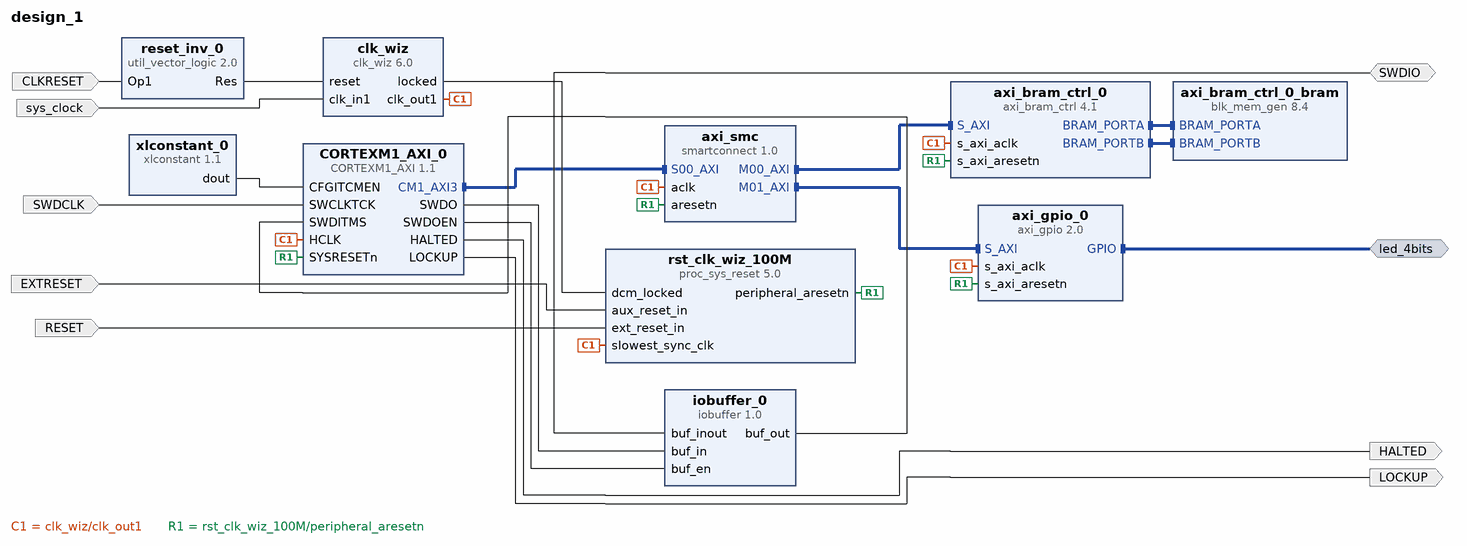
[diagram p0: block diagram of the top level]
# Vivado block design design_1, xc7a35ticsg324-1L, Vivado 2022.2
create_bd_design design_1

create_bd_intf_port -mode Master -vlnv xilinx.com:interface:gpio_rtl:1.0 led_4bits
create_bd_port -dir I -type rst CLKRESET
set_property -dict {CONFIG.POLARITY ACTIVE_LOW} [get_bd_ports CLKRESET]
create_bd_port -dir I -type rst EXTRESET
create_bd_port -dir O HALTED
create_bd_port -dir O LOCKUP
create_bd_port -dir I -type rst RESET
set_property -dict {CONFIG.POLARITY ACTIVE_LOW} [get_bd_ports RESET]
create_bd_port -dir I SWDCLK
create_bd_port -dir IO SWDIO
create_bd_port -dir I -type clk sys_clock
set_property -dict {CONFIG.FREQ_HZ 100000000 CONFIG.PHASE 0.0} [get_bd_ports sys_clock]

create_bd_cell -type ip -vlnv arm.com:CortexM:CORTEXM1_AXI:1.1 CORTEXM1_AXI_0
create_bd_cell -type ip -vlnv xilinx.com:ip:axi_bram_ctrl:4.1 axi_bram_ctrl_0
create_bd_cell -type ip -vlnv xilinx.com:ip:blk_mem_gen:8.4 axi_bram_ctrl_0_bram
set_property -dict {CONFIG.Memory_Type True_Dual_Port_RAM} [get_bd_cells axi_bram_ctrl_0_bram]
create_bd_cell -type ip -vlnv xilinx.com:ip:axi_gpio:2.0 axi_gpio_0
set_property -dict {CONFIG.GPIO_BOARD_INTERFACE led_4bits CONFIG.USE_BOARD_FLOW true} [get_bd_cells axi_gpio_0]
create_bd_cell -type ip -vlnv xilinx.com:ip:smartconnect:1.0 axi_smc
set_property -dict {CONFIG.NUM_MI 2 CONFIG.NUM_SI 1} [get_bd_cells axi_smc]
create_bd_cell -type ip -vlnv xilinx.com:ip:clk_wiz:6.0 clk_wiz
set_property -dict [list \
  CONFIG.CLK_IN1_BOARD_INTERFACE sys_clock \
  CONFIG.RESET_BOARD_INTERFACE reset \
  CONFIG.USE_BOARD_FLOW true \
] [get_bd_cells clk_wiz]
create_bd_cell -type ip -vlnv st.com:user:iobuffer:1.0 iobuffer_0
create_bd_cell -type ip -vlnv xilinx.com:ip:util_vector_logic:2.0 reset_inv_0
set_property -dict {CONFIG.C_OPERATION not CONFIG.C_SIZE 1} [get_bd_cells reset_inv_0]
create_bd_cell -type ip -vlnv xilinx.com:ip:proc_sys_reset:5.0 rst_clk_wiz_100M
set_property -dict {CONFIG.RESET_BOARD_INTERFACE reset CONFIG.USE_BOARD_FLOW true} [get_bd_cells rst_clk_wiz_100M]
create_bd_cell -type ip -vlnv xilinx.com:ip:xlconstant:1.1 xlconstant_0
set_property -dict {CONFIG.CONST_VAL 0 CONFIG.CONST_WIDTH 2} [get_bd_cells xlconstant_0]

# ---- connections ----

connect_bd_intf_net [get_bd_intf_pins CORTEXM1_AXI_0/CM1_AXI3] [get_bd_intf_pins axi_smc/S00_AXI]
connect_bd_intf_net [get_bd_intf_pins axi_bram_ctrl_0_bram/BRAM_PORTA] [get_bd_intf_pins axi_bram_ctrl_0/BRAM_PORTA]
connect_bd_intf_net [get_bd_intf_pins axi_bram_ctrl_0_bram/BRAM_PORTB] [get_bd_intf_pins axi_bram_ctrl_0/BRAM_PORTB]
connect_bd_intf_net [get_bd_intf_ports led_4bits] [get_bd_intf_pins axi_gpio_0/GPIO]
connect_bd_intf_net [get_bd_intf_pins axi_smc/M00_AXI] [get_bd_intf_pins axi_bram_ctrl_0/S_AXI]
connect_bd_intf_net [get_bd_intf_pins axi_smc/M01_AXI] [get_bd_intf_pins axi_gpio_0/S_AXI]
connect_bd_net [get_bd_pins CORTEXM1_AXI_0/HALTED] [get_bd_ports HALTED]
connect_bd_net [get_bd_pins CORTEXM1_AXI_0/LOCKUP] [get_bd_ports LOCKUP]
connect_bd_net [get_bd_pins CORTEXM1_AXI_0/SWDO] [get_bd_pins iobuffer_0/buf_in]
connect_bd_net [get_bd_pins CORTEXM1_AXI_0/SWDOEN] [get_bd_pins iobuffer_0/buf_en]
connect_bd_net [get_bd_ports SWDIO] [get_bd_pins iobuffer_0/buf_inout]
connect_bd_net -net SWCLKTCK_0_1 [get_bd_ports SWDCLK] [get_bd_pins CORTEXM1_AXI_0/SWCLKTCK]
connect_bd_net -net aux_reset_in_0_1 [get_bd_ports EXTRESET] [get_bd_pins rst_clk_wiz_100M/aux_reset_in]
connect_bd_net [get_bd_pins clk_wiz/clk_out1] \
  [get_bd_pins CORTEXM1_AXI_0/HCLK] [get_bd_pins axi_smc/aclk] [get_bd_pins rst_clk_wiz_100M/slowest_sync_clk] \
  [get_bd_pins axi_bram_ctrl_0/s_axi_aclk] [get_bd_pins axi_gpio_0/s_axi_aclk]
connect_bd_net [get_bd_pins clk_wiz/locked] [get_bd_pins rst_clk_wiz_100M/dcm_locked]
connect_bd_net [get_bd_pins iobuffer_0/buf_out] [get_bd_pins CORTEXM1_AXI_0/SWDITMS]
connect_bd_net -net reset_0_1 [get_bd_ports RESET] [get_bd_pins rst_clk_wiz_100M/ext_reset_in]
connect_bd_net -net reset_1 [get_bd_ports CLKRESET] [get_bd_pins reset_inv_0/Op1]
connect_bd_net [get_bd_pins reset_inv_0/Res] [get_bd_pins clk_wiz/reset]
connect_bd_net [get_bd_pins rst_clk_wiz_100M/peripheral_aresetn] \
  [get_bd_pins CORTEXM1_AXI_0/SYSRESETn] [get_bd_pins axi_bram_ctrl_0/s_axi_aresetn] [get_bd_pins axi_smc/aresetn] \
  [get_bd_pins axi_gpio_0/s_axi_aresetn]
connect_bd_net [get_bd_ports sys_clock] [get_bd_pins clk_wiz/clk_in1]
connect_bd_net [get_bd_pins xlconstant_0/dout] [get_bd_pins CORTEXM1_AXI_0/CFGITCMEN]

# ---- address map ----
assign_bd_address -offset 0x00000000 -range 8K -target_address_space [get_bd_addr_spaces CORTEXM1_AXI_0/CM1_AXI3] [get_bd_addr_segs axi_bram_ctrl_0/S_AXI/Mem0]
assign_bd_address -offset 0x40000000 -range 64K -target_address_space [get_bd_addr_spaces CORTEXM1_AXI_0/CM1_AXI3] [get_bd_addr_segs axi_gpio_0/S_AXI/Reg]

validate_bd_design
save_bd_design
